# EAGLE design segment (EAGLE 5.10)
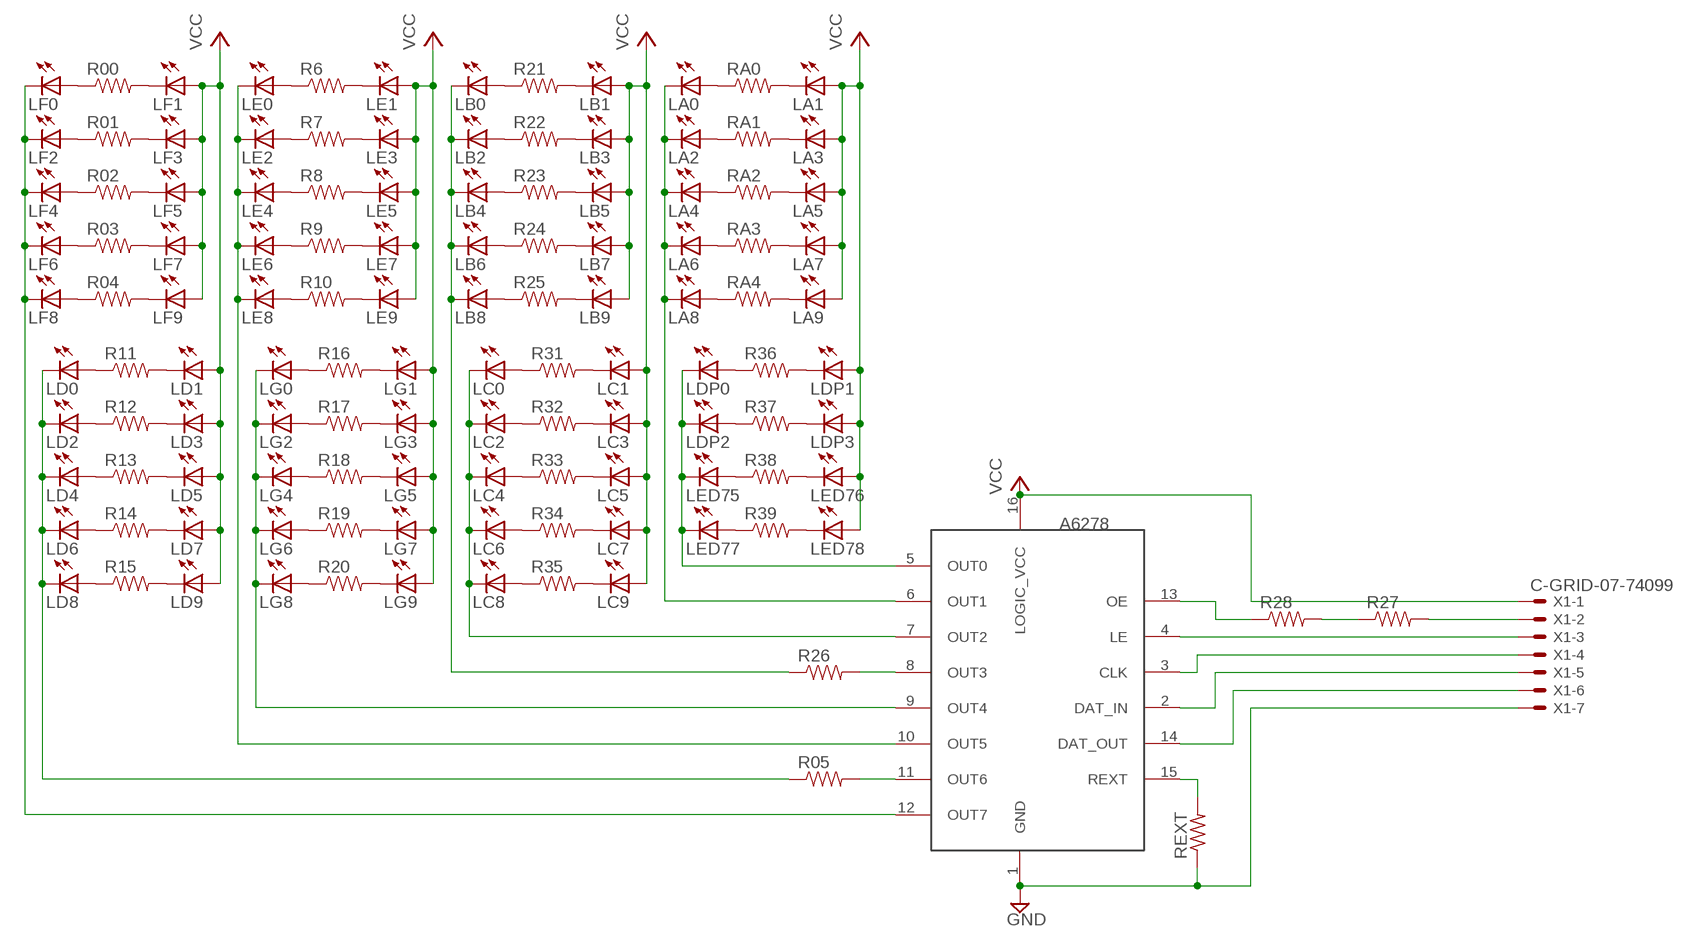
[diagram p0: schematic, sheet 1]

## Parts
LA0  LEDSMT1206  [1206]
LA1  LEDSMT1206  [1206]
LA2  LEDSMT1206  [1206]
LA3  LEDSMT1206  [1206]
LA4  LEDSMT1206  [1206]
LA5  LEDSMT1206  [1206]
LA6  LEDSMT1206  [1206]
LA7  LEDSMT1206  [1206]
LA8  LEDSMT1206  [1206]
LA9  LEDSMT1206  [1206]
LB0  LEDSMT1206  [1206]
LB1  LEDSMT1206  [1206]
LB2  LEDSMT1206  [1206]
LB3  LEDSMT1206  [1206]
LB4  LEDSMT1206  [1206]
LB5  LEDSMT1206  [1206]
LB6  LEDSMT1206  [1206]
LB7  LEDSMT1206  [1206]
LB8  LEDSMT1206  [1206]
LB9  LEDSMT1206  [1206]
LC0  LEDSMT1206  [1206]
LC1  LEDSMT1206  [1206]
LC2  LEDSMT1206  [1206]
LC3  LEDSMT1206  [1206]
LC4  LEDSMT1206  [1206]
LC5  LEDSMT1206  [1206]
LC6  LEDSMT1206  [1206]
LC7  LEDSMT1206  [1206]
LC8  LEDSMT1206  [1206]
LC9  LEDSMT1206  [1206]
LD0  LEDSMT1206  [1206]
LD1  LEDSMT1206  [1206]
LD2  LEDSMT1206  [1206]
LD3  LEDSMT1206  [1206]
LD4  LEDSMT1206  [1206]
LD5  LEDSMT1206  [1206]
LD6  LEDSMT1206  [1206]
LD7  LEDSMT1206  [1206]
LD8  LEDSMT1206  [1206]
LD9  LEDSMT1206  [1206]
LDP0  LEDSMT1206  [1206]
LDP1  LEDSMT1206  [1206]
LDP2  LEDSMT1206  [1206]
LDP3  LEDSMT1206  [1206]
LE0  LEDSMT1206  [1206]
LE1  LEDSMT1206  [1206]
LE2  LEDSMT1206  [1206]
LE3  LEDSMT1206  [1206]
LE4  LEDSMT1206  [1206]
LE5  LEDSMT1206  [1206]
LE6  LEDSMT1206  [1206]
LE7  LEDSMT1206  [1206]
LE8  LEDSMT1206  [1206]
LE9  LEDSMT1206  [1206]
LED75  LEDSMT1206  [1206]
LED76  LEDSMT1206  [1206]
LED77  LEDSMT1206  [1206]
LED78  LEDSMT1206  [1206]
LF0  LEDSMT1206  [1206]
LF1  LEDSMT1206  [1206]
LF2  LEDSMT1206  [1206]
LF3  LEDSMT1206  [1206]
LF4  LEDSMT1206  [1206]
LF5  LEDSMT1206  [1206]
LF6  LEDSMT1206  [1206]
LF7  LEDSMT1206  [1206]
LF8  LEDSMT1206  [1206]
LF9  LEDSMT1206  [1206]
LG0  LEDSMT1206  [1206]
LG1  LEDSMT1206  [1206]
LG2  LEDSMT1206  [1206]
LG3  LEDSMT1206  [1206]
LG4  LEDSMT1206  [1206]
LG5  LEDSMT1206  [1206]
LG6  LEDSMT1206  [1206]
LG7  LEDSMT1206  [1206]
LG8  LEDSMT1206  [1206]
LG9  LEDSMT1206  [1206]
R00  RESISTOR1206  [1206]
R01  RESISTOR1206  [1206]
R02  RESISTOR1206  [1206]
R03  RESISTOR1206  [1206]
R04  RESISTOR1206  [1206]
R05  RESISTOR1206  [1206]
R6  RESISTOR1206  [1206]
R7  RESISTOR1206  [1206]
R8  RESISTOR1206  [1206]
R9  RESISTOR1206  [1206]
R10  RESISTOR1206  [1206]
R11  RESISTOR1206  [1206]
R12  RESISTOR1206  [1206]
R13  RESISTOR1206  [1206]
R14  RESISTOR1206  [1206]
R15  RESISTOR1206  [1206]
R16  RESISTOR1206  [1206]
R17  RESISTOR1206  [1206]
R18  RESISTOR1206  [1206]
R19  RESISTOR1206  [1206]
R20  RESISTOR1206  [1206]
R21  RESISTOR1206  [1206]
R22  RESISTOR1206  [1206]
R23  RESISTOR1206  [1206]
R24  RESISTOR1206  [1206]
R25  RESISTOR1206  [1206]
R26  RESISTOR1206  [1206]
R27  RESISTOR1206  [1206]
R28  RESISTOR1206  [1206]
R31  RESISTOR1206  [1206]
R32  RESISTOR1206  [1206]
R33  RESISTOR1206  [1206]
R34  RESISTOR1206  [1206]
R35  RESISTOR1206  [1206]
R36  RESISTOR1206  [1206]
R37  RESISTOR1206  [1206]
R38  RESISTOR1206  [1206]
R39  RESISTOR1206  [1206]
RA0  RESISTOR1206  [1206]
RA1  RESISTOR1206  [1206]
RA2  RESISTOR1206  [1206]
RA3  RESISTOR1206  [1206]
RA4  RESISTOR1206  [1206]
REXT  R-US_R1206  [R1206]
U$1  A6278  [SO16W]
X1  C-GRID-07-74099  [74099-07]

## Nets
GND: REXT.1 U$1.1(GND) X1.7
N$1: LF0.A R00.1
N$2: LF1.C R00.2
N$3: LF2.A R01.1
N$4: LF3.C R01.2
N$5: LF4.A R02.1
N$6: LF5.C R02.2
N$7: LF6.A R03.1
N$8: LF7.C R03.2
N$9: LF8.A R04.1
N$10: LF9.C R04.2
N$11: LE0.A R6.1
N$12: LE1.C R6.2
N$13: LE2.A R7.1
N$14: LE3.C R7.2
N$15: LE4.A R8.1
N$16: LE5.C R8.2
N$17: LE6.A R9.1
N$18: LE7.C R9.2
N$19: LE8.A R10.1
N$20: LE9.C R10.2
N$21: LD0.A R11.1
N$22: LD1.C R11.2
N$23: LD2.A R12.1
N$24: LD3.C R12.2
N$25: LD4.A R13.1
N$26: LD5.C R13.2
N$27: LD6.A R14.1
N$28: LD7.C R14.2
N$29: LD8.A R15.1
N$30: LD9.C R15.2
N$31: LG0.A R16.1
N$32: LG1.C R16.2
N$33: LG2.A R17.1
N$34: LG3.C R17.2
N$35: LG4.A R18.1
N$36: LG5.C R18.2
N$37: LG6.A R19.1
N$38: LG7.C R19.2
N$39: LG8.A R20.1
N$40: LG9.C R20.2
N$41: LB0.A R21.1
N$42: LB1.C R21.2
N$43: LB2.A R22.1
N$44: LB3.C R22.2
N$45: LB4.A R23.1
N$46: LB5.C R23.2
N$47: LB6.A R24.1
N$48: LB7.C R24.2
N$49: LB8.A R25.1
N$50: LB9.C R25.2
N$51: LA0.A RA0.1
N$52: LA1.C RA0.2
N$53: LA2.A RA1.1
N$54: LA3.C RA1.2
N$55: LA4.A RA2.1
N$56: LA5.C RA2.2
N$57: LA6.A RA3.1
N$58: LA7.C RA3.2
N$59: LA8.A RA4.1
N$60: LA9.C RA4.2
N$61: LC0.A R31.1
N$62: LC1.C R31.2
N$63: LC2.A R32.1
N$64: LC3.C R32.2
N$65: LC4.A R33.1
N$66: LC5.C R33.2
N$67: LC6.A R34.1
N$68: LC7.C R34.2
N$69: LC8.A R35.1
N$70: LC9.C R35.2
N$71: LDP0.A R36.1
N$72: LDP1.C R36.2
N$73: LDP2.A R37.1
N$74: LDP3.C R37.2
N$75: LED75.A R38.1
N$76: LED76.C R38.2
N$77: LED77.A R39.1
N$78: LED78.C R39.2
N$79: LF0.C LF2.C LF4.C LF6.C LF8.C U$1.12(OUT7)
N$80: LE0.C LE2.C LE4.C LE6.C LE8.C U$1.10(OUT5)
N$81: LB0.C LB2.C LB4.C LB6.C LB8.C R26.1
N$82: LA0.C LA2.C LA4.C LA6.C LA8.C U$1.6(OUT1)
N$83: LD0.C LD2.C LD4.C LD6.C LD8.C R05.1
N$84: LG0.C LG2.C LG4.C LG6.C LG8.C U$1.9(OUT4)
N$85: LC0.C LC2.C LC4.C LC6.C LC8.C U$1.7(OUT2)
N$86: REXT.2 U$1.15(REXT)
N$87: LDP0.C LDP2.C LED75.C LED77.C U$1.5(OUT0)
N$88: R28.1 U$1.13(OE)
N$89: U$1.4(LE) X1.3
N$90: U$1.3(CLK) X1.4
N$91: U$1.2(DAT_IN) X1.5
N$92: U$1.14(DAT_OUT) X1.6
N$93: R05.2 U$1.11(OUT6)
N$94: R26.2 U$1.8(OUT3)
N$95: R27.2 X1.2
N$96: R27.1 R28.2
VCC: LA1.A LA3.A LA5.A LA7.A LA9.A LB1.A LB3.A LB5.A LB7.A LB9.A LC1.A LC3.A LC5.A LC7.A LC9.A LD1.A LD3.A LD5.A LD7.A LD9.A LDP1.A LDP3.A LE1.A LE3.A LE5.A LE7.A LE9.A LED76.A LED78.A LF1.A LF3.A LF5.A LF7.A LF9.A LG1.A LG3.A LG5.A LG7.A LG9.A U$1.16(LOGIC_VCC) X1.1

## Library data of the parts
LA0 LA1-LA9 LB0 LB1-LB9 LC0 LC1-LC9 LD0 LD1-LD9 LDP0 LDP1-LDP3 LE0 LE1-LE9 LED75-LED78 LF0 LF1-LF9 LG0 LG1-LG9 = led:LED: LED OSRAM: - CHIPLED LG R971, LG N971, LY N971, LG Q971, LY Q971, LO R971, LY R971 LH N974, LH R974 LS Q976, LO Q976, LY Q976 LO Q996 - Hyper CHIPLED LW Q18S LB Q993, LB Q99A, LB R99A - SideLED LS A670, LO A670, LY A670, LG A670, LP A670 LB A673, LV A673, LT A673, LW A673 LH A674 LY A675 LS A676, LA A676, LO A676, LY A676, LW A676 LS A679, LY A679, LG A679 - Hyper Micro SIDELED® LS Y876, LA Y876, LO Y876, LY Y876 LT Y87S - SmartLED LW L88C, LW L88S LB L89C, LB L89S, LG L890 LS L89K, LO L89K, LY L89K LS L896, LA L896, LO L896, LY L896 - TOPLED LS T670, LO T670, LY T670, LG T670, LP T670 LSG T670, LSP T670, LSY T670, LOP T670, LYG T670 LG T671, LOG T671, LSG T671 LB T673, LV T673, LT T673, LW T673 LH T674 LS T676, LA T676, LO T676, LY T676, LB T676, LH T676, LSB T676, LW T676 LB T67C, LV T67C, LT T67C, LS T67K, LO T67K, LY T67K, LW E67C LS E67B, LA E67B, LO E67B, LY E67B, LB E67C, LV E67C, LT E67C LW T67C LS T679, LY T679, LG T679 LS T770, LO T770, LY T770, LG T770, LP T770 LB T773, LV T773, LT T773, LW T773 LH T774 LS E675, LA E675, LY E675, LS T675 LS T776, LA T776, LO T776, LY T776, LB T776 LHGB T686 LT T68C, LB T68C - Hyper Mini TOPLED® LB M676 - Mini TOPLED Santana® LG M470 LS M47K, LO M47K, LY M47K Source: http://www.osram.convergy.de LUXEON: - LUMILED® LXK2-PW12-R00, LXK2-PW12-S00, LXK2-PW14-U00, LXK2-PW14-V00 LXK2-PM12-R00, LXK2-PM12-S00, LXK2-PM14-U00 LXK2-PE12-Q00, LXK2-PE12-R00, LXK2-PE12-S00, LXK2-PE14-T00, LXK2-PE14-U00 LXK2-PB12-K00, LXK2-PB12-L00, LXK2-PB12-M00, LXK2-PB14-N00, LXK2-PB14-P00, LXK2-PB14-Q00 LXK2-PR12-L00, LXK2-PR12-M00, LXK2-PR14-Q00, LXK2-PR14-R00 LXK2-PD12-Q00, LXK2-PD12-R00, LXK2-PD12-S00 LXK2-PH12-R00, LXK2-PH12-S00 LXK2-PL12-P00, LXK2-PL12-Q00, LXK2-PL12-R00 Source: www.luxeon.com KINGBRIGHT: KA-3528ASYC Source: www.kingbright.com
R00 R01-R05 R6-R28 R31-R39 RA0 RA1-RA4 = SparkFun:RESISTOR: Resistor Basic schematic elements and footprints for 0603, 1206, and PTH 1/10th watt (small) resistors.
REXT = rcl:R-US_: RESISTOR, American symbol
U$1 = allegro-sr:A6278
X1 = con-molex:C-GRID-07: CONNECTOR wire to board 2.54 mm (0.100") pitch header

## Board
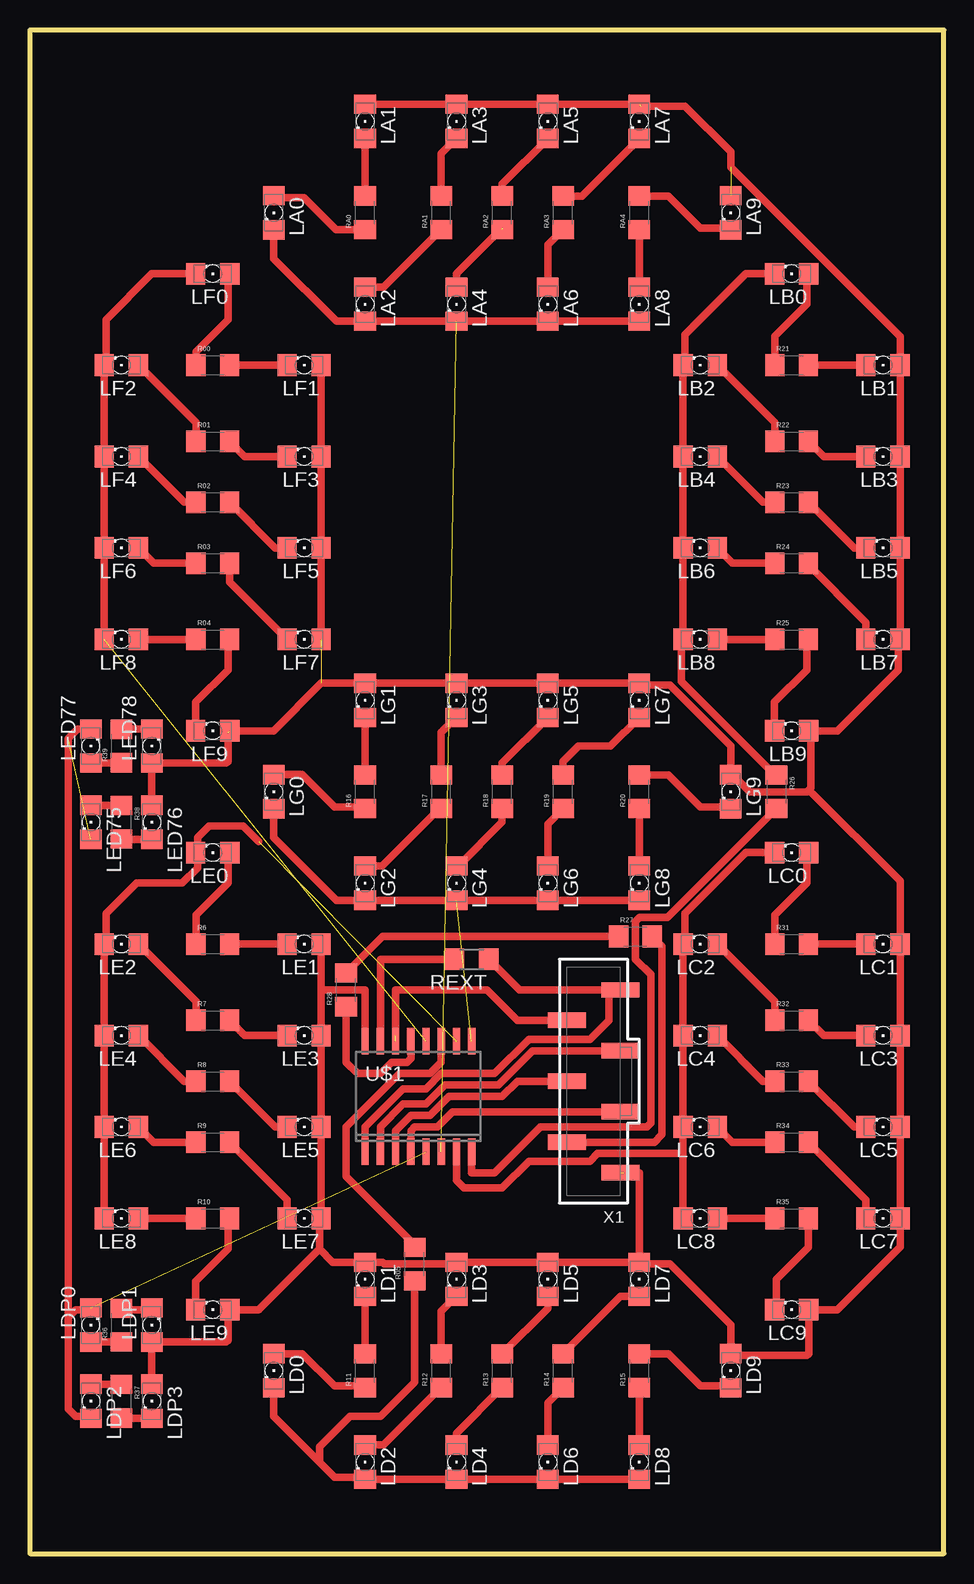
[diagram p1: board, top side]

Size 76.2 x 127 mm. Coordinates in mm from the lower left corner, seen from the top.
Outline: 0,0 0,127 76.2,127 76.2,0 0,0
Copper layers (1*16): Top 0.035mm / dielectric 1.5mm / Bottom 0.035mm
Design rules "default": minimum track width 10mil, minimum drill 24mil, track to track 8mil, track to pad 8mil, pad to pad 8mil, via to via 8mil, smd to smd 8mil, copper to edge 40mil, drill to drill 8mil, minimum pad ring 10mil, minimum via ring 8mil, stop-mask expansion 4mil, vias tented up to drill 0mil, thermal gap 10mil

### Footprints (pad centres in the part's own frame; a part is rotated, then mirrored left to right if it is on the bottom)
1206 = smd 1.6 x 1.803: A -1.422,0; C 1.422,0
1206' = smd 1.6 x 1.8: 1 -1.4,0; 2 1.4,0
R1206 = smd 1.6 x 1.803: 1 -1.422,0; 2 1.422,0
SO16W = smd 0.6 x 2.2: 1 -4.445,-4.6; 2 -3.175,-4.6; 3 -1.905,-4.6; 4 -0.635,-4.6; 5 0.635,-4.6; 6 1.905,-4.6; 7 3.175,-4.6; 8 4.445,-4.6; 9 4.445,4.6; 10 3.175,4.6; 11 1.905,4.6; 12 0.635,4.6; 13 -0.635,4.6; 14 -1.905,4.6; 15 -3.175,4.6; 16 -4.445,4.6
74099-07 = smd 1.27 x 3.175: 1 -7.62,-2.223; 2 -5.08,2.223; 3 -2.54,-2.223; 4 0,2.223; 5 2.54,-2.223; 6 5.08,2.223; 7 7.62,-2.223

### Placement (x,y rotation side)
LA0  20.32,111.76 270 top
LA1  27.94,119.38 270 top
LA2  27.94,104.14 270 top
LA3  35.56,119.38 270 top
LA4  35.56,104.14 270 top
LA5  43.18,119.38 270 top
LA6  43.18,104.14 270 top
LA7  50.8,119.38 270 top
LA8  50.8,104.14 270 top
LA9  58.42,111.76 270 top
LB0  63.5,106.68 180 top
LB1  71.12,99.06 180 top
LB2  55.88,99.06 180 top
LB3  71.12,91.44 180 top
LB4  55.88,91.44 180 top
LB5  71.12,83.82 180 top
LB6  55.88,83.82 180 top
LB7  71.12,76.2 180 top
LB8  55.88,76.2 180 top
LB9  63.5,68.58 180 top
LC0  63.5,58.42 180 top
LC1  71.12,50.8 180 top
LC2  55.88,50.8 180 top
LC3  71.12,43.18 180 top
LC4  55.88,43.18 180 top
LC5  71.12,35.56 180 top
LC6  55.88,35.56 180 top
LC7  71.12,27.94 180 top
LC8  55.88,27.94 180 top
LC9  63.5,20.32 180 top
LD0  20.32,15.24 270 top
LD1  27.94,22.86 270 top
LD2  27.94,7.62 270 top
LD3  35.56,22.86 270 top
LD4  35.56,7.62 270 top
LD5  43.18,22.86 270 top
LD6  43.18,7.62 270 top
LD7  50.8,22.86 270 top
LD8  50.8,7.62 270 top
LD9  58.42,15.24 270 top
LDP0  5.08,19.05 90 top
LDP1  10.16,19.05 90 top
LDP2  5.08,12.7 270 top
LDP3  10.16,12.7 270 top
LE0  15.24,58.42 180 top
LE1  22.86,50.8 180 top
LE2  7.62,50.8 180 top
LE3  22.86,43.18 180 top
LE4  7.62,43.18 180 top
LE5  22.86,35.56 180 top
LE6  7.62,35.56 180 top
LE7  22.86,27.94 180 top
LE8  7.62,27.94 180 top
LE9  15.24,20.32 180 top
LED75  5.08,60.96 270 top
LED76  10.16,60.96 270 top
LED77  5.08,67.31 90 top
LED78  10.16,67.31 90 top
LF0  15.24,106.68 180 top
LF1  22.86,99.06 180 top
LF2  7.62,99.06 180 top
LF3  22.86,91.44 180 top
LF4  7.62,91.44 180 top
LF5  22.86,83.82 180 top
LF6  7.62,83.82 180 top
LF7  22.86,76.2 180 top
LF8  7.62,76.2 180 top
LF9  15.24,68.58 180 top
LG0  20.32,63.5 270 top
LG1  27.94,71.12 270 top
LG2  27.94,55.88 270 top
LG3  35.56,71.12 270 top
LG4  35.56,55.88 270 top
LG5  43.18,71.12 270 top
LG6  43.18,55.88 270 top
LG7  50.8,71.12 270 top
LG8  50.8,55.88 270 top
LG9  58.42,63.5 270 top
R00  [1206']  15.24,99.06 0 top
R01  [1206']  15.24,92.71 0 top
R02  [1206']  15.24,87.63 0 top
R03  [1206']  15.24,82.55 0 top
R04  [1206']  15.24,76.2 0 top
R05  [1206']  32.07,24.13 90 top
R6  [1206']  15.24,50.8 0 top
R7  [1206']  15.24,44.45 0 top
R8  [1206']  15.24,39.37 0 top
R9  [1206']  15.24,34.29 0 top
R10  [1206']  15.24,27.94 0 top
R11  [1206']  27.94,15.24 90 top
R12  [1206']  34.29,15.24 90 top
R13  [1206']  39.37,15.24 90 top
R14  [1206']  44.45,15.24 90 top
R15  [1206']  50.8,15.24 90 top
R16  [1206']  27.94,63.5 90 top
R17  [1206']  34.29,63.5 90 top
R18  [1206']  39.37,63.5 90 top
R19  [1206']  44.45,63.5 90 top
R20  [1206']  50.8,63.5 90 top
R21  [1206']  63.5,99.06 0 top
R22  [1206']  63.5,92.71 0 top
R23  [1206']  63.5,87.63 0 top
R24  [1206']  63.5,82.55 0 top
R25  [1206']  63.5,76.2 0 top
R26  [1206']  62.23,63.5 270 top
R27  [1206']  50.48,51.44 0 top
R28  [1206']  26.35,46.99 90 top
R31  [1206']  63.5,50.8 0 top
R32  [1206']  63.5,44.45 0 top
R33  [1206']  63.5,39.37 0 top
R34  [1206']  63.5,34.29 0 top
R35  [1206']  63.5,27.94 0 top
R36  [1206']  7.62,19.05 90 top
R37  [1206']  7.62,12.7 270 top
R38  [1206']  7.62,60.96 270 top
R39  [1206']  7.62,67.31 90 top
RA0  [1206']  27.94,111.76 90 top
RA1  [1206']  34.29,111.76 90 top
RA2  [1206']  39.37,111.76 90 top
RA3  [1206']  44.45,111.76 90 top
RA4  [1206']  50.8,111.76 90 top
REXT  36.83,49.53 180 top
U$1  32.38,38.1 0 top
X1  46.99,39.37 90 top

### Tracks (layer width: path | path; a pad name or v marks a point on that pad's centre or on a via)
GND
  Top 0.61: 48.58,46.99 40.79,46.99 REXT.1 | 48.58,46.99 X1.7 | U$1.1 27.94,35.56 31.11,38.73 33.02,38.73 34.29,40.01 38.73,40.01 41.59,42.86 46.67,42.86 48.26,44.45 48.26,46.67 48.58,46.99
N$1
  Top 0.61: LF0.A 16.51,106.53 16.51,102.87 13.84,100.2 R00.1
N$2
  Top 0.61: R00.2 LF1.C
N$3
  Top 0.61: LF2.A 13.84,94.26 R01.1
N$4
  Top 0.61: R01.2 17.91,91.44 LF3.C
N$5
  Top 0.61: LF4.A 12.85,87.63 R02.1
N$6
  Top 0.61: R02.2 20.45,83.82 LF5.C
N$7
  Top 0.61: LF6.A 10.31,82.55 R03.1
N$8
  Top 0.61: LF7.C 16.64,81 R03.2
N$9
  Top 0.61: LF8.A R04.1
N$10
  Top 0.61: R04.2 16.51,76.07 16.51,73.66 13.82,70.97 LF9.C
N$11
  Top 0.61: LE0.A 16.51,58.27 16.51,55.88 13.84,53.21 R6.1
N$12
  Top 0.61: R6.2 LE1.C
N$13
  Top 0.61: LE2.A 13.84,46 R7.1
N$14
  Top 0.61: R7.2 17.91,43.18 LE3.C
N$15
  Top 0.61: LE4.A 12.85,39.37 R8.1
N$16
  Top 0.61: R8.2 20.45,35.56 LE5.C
N$17
  Top 0.61: LE6.A 10.31,34.29 R9.1
N$18
  Top 0.61: R9.2 21.44,29.49 LE7.C
N$19
  Top 0.61: 8.89,27.94 LE8.A R10.1
N$20
  Top 0.61: R10.2 16.51,27.81 16.51,25.4 13.82,22.71 LE9.C
N$21
  Top 0.61: R11.1 27.81,13.97 25.4,13.97 22.71,16.66 LD0.A
N$22
  Top 0.61: R11.2 LD1.C
N$23
  Top 0.61: R12.1 29.49,9.04 LD2.A
N$24
  Top 0.61: LD3.C 34.29,20.17 R12.2
N$25
  Top 0.61: R13.1 35.56,10.03 LD4.A
N$26
  Top 0.61: R13.2 43.18,20.45 LD5.C
N$27
  Top 0.61: R14.1 43.18,12.57 LD6.A
N$28
  Top 0.61: R14.2 49.25,21.44 LD7.C
N$29
  Top 0.61: LD8.A R15.1
N$30
  Top 0.61: LD9.C 58.27,13.97 55.88,13.97 53.21,16.64 R15.2
N$31
  Top 0.61: R16.1 27.94,62.23 25.4,62.23 22.71,64.92 LG0.A
N$32
  Top 0.61: 27.94,64.77 R16.2 LG1.C
N$33
  Top 0.61: R17.1 34.29,62.23 29.36,57.3 LG2.A
N$34
  Top 0.61: LG3.C 34.29,68.43 R17.2
N$35
  Top 0.61: R18.1 39.37,60.96 35.71,57.3 LG4.A
N$36
  Top 0.61: LG5.C 39.37,65.89 R18.2
N$37
  Top 0.61: R19.1 43.18,60.83 LG6.A
N$38
  Top 0.61: LG7.C 48.41,67.31 45.72,67.31 44.45,66.04 R19.2
N$39
  Top 0.61: LG8.A R20.1
N$40
  Top 0.61: LG9.C 58.27,62.23 55.88,62.23 53.21,64.9 R20.2
N$41
  Top 0.61: LB0.A 64.77,106.53 64.77,104.14 62.1,101.47 R21.1
N$42
  Top 0.61: R21.2 LB1.C
N$43
  Top 0.61: LB2.A 62.1,94.26 R22.1
N$44
  Top 0.61: R22.2 66.17,91.44 LB3.C
N$45
  Top 0.61: LB4.A 61.11,87.63 R23.1
N$46
  Top 0.61: R23.2 68.71,83.82 LB5.C
N$47
  Top 0.61: LB6.A 58.57,82.55 R24.1
N$48
  Top 0.61: R24.2 64.77,82.55 69.7,77.62 LB7.C
N$49
  Top 0.61: LB8.A R25.1
N$50
  Top 0.61: R25.2 64.77,76.07 64.77,73.66 62.08,70.97 LB9.C
N$51
  Top 0.61: RA0.1 25.53,110.36 22.86,113.03 20.47,113.03 LA0.A
N$52
  Top 0.61: RA0.2 LA1.C
N$53
  Top 0.61: LA2.A 29.49,105.56 RA1.1
N$54
  Top 0.61: RA1.2 34.29,116.69 LA3.C
N$55  (1 unrouted)
  Top 0.61: LA4.A 35.56,106.68 39.37,110.49
N$56
  Top 0.61: RA2.2 39.37,114.15 LA5.C
N$57
  Top 0.61: LA6.A 43.18,109.09 RA3.1
N$58
  Top 0.61: RA3.2 46,113.16 LA7.C
N$59
  Top 0.61: LA8.A RA4.1
N$60
  Top 0.61: RA4.2 53.21,113.16 55.88,110.49 58.27,110.49 LA9.C
N$61
  Top 0.61: LC0.A 64.77,58.42 64.77,55.88 62.1,53.21 R31.1
N$62
  Top 0.61: 69.85,50.8 LC1.C R31.2
N$63
  Top 0.61: LC2.A 62.1,46 R32.1
N$64
  Top 0.61: R32.2 66.17,43.18 LC3.C
N$65
  Top 0.61: LC4.A 61.11,39.37 R33.1
N$66
  Top 0.61: R33.2 68.71,35.56 LC5.C
N$67
  Top 0.61: LC6.A 58.57,34.29 R34.1
N$68
  Top 0.61: R34.2 69.7,29.49 LC7.C
N$69
  Top 0.61: LC8.A R35.1
N$70
  Top 0.61: LC9.C 62.23,20.47 62.23,22.86 64.9,25.53 R35.2
N$71
  Top 0.61: R36.1 5.1,17.65 LDP0.A
N$72
  Top 0.61: LDP1.C 10.16,20.32 7.75,20.32 R36.2
N$73
  Top 0.61: R37.1 5.1,14.1 LDP2.A
N$74
  Top 0.61: LDP3.C 7.64,11.28 R37.2
N$75
  Top 0.61: R38.1 5.1,62.36 LED75.A
N$76
  Top 0.61: LED76.C 7.64,59.54 R38.2
N$77
  Top 0.61: LED77.A 7.6,65.89 R39.1
N$78
  Top 0.61: R39.2 10.14,68.71 LED78.C
N$79  (1 unrouted)
  Top 0.61: LF0.C 10.16,106.68 6.35,102.87 6.35,99.21 LF2.C LF4.C LF6.C LF8.C
N$80  (1 unrouted)
  Top 0.61: 6.35,27.79 LE8.C LE6.C LE4.C LE2.C 6.35,50.95 6.35,53.34 8.89,55.88 12.7,55.88 13.97,57.15 13.97,58.42 | 13.97,58.42 LE0.C | 13.97,58.42 13.97,59.69 14.92,60.64 17.78,60.64 19.05,59.37
N$81
  Top 0.61: LB0.C 59.69,106.68 54.61,101.6 54.61,99.21 LB2.C LB4.C LB6.C LB8.C 54.29,76.03 54.29,72.71 62.1,64.9 R26.1
N$82  (1 unrouted)
  Top 0.61: LA8.C LA6.C LA4.C LA2.C 25.55,102.72 20.32,107.95 LA0.C
N$83
  Top 0.61: LD8.C LD6.C LD4.C LD2.C 27.79,6.35 25.4,6.35 24.13,7.62 | LD0.C 20.32,11.43 24.13,7.62 | 24.13,7.62 24.13,8.89 26.67,11.43 29.21,11.43 32.07,14.29 R05.1
N$84  (1 unrouted)
  Top 0.61: LG8.C LG6.C LG4.C LG2.C 25.55,54.46 20.32,59.69 LG0.C
N$85
  Top 0.61: LC8.C 54.61,27.94 54.46,28.09 54.46,33.34 | 54.46,33.34 LC6.C LC4.C LC2.C 54.61,50.95 54.61,53.34 59.69,58.42 LC0.C | U$1.7 35.56,31.11 36.2,30.48 39.37,30.48 41.59,32.7 46.67,32.7 47.31,33.34 54.46,33.34
N$86
  Top 0.61: U$1.15 29.21,49.53 REXT.2
N$87  (2 unrouted)
  Top 0.61: 3.17,19.68 3.81,20.32 4.93,20.32 LDP0.C | LED77.C 3.96,68.73 3.17,67.94 3.17,19.68 | 3.17,19.68 3.17,12.06 3.81,11.43 4.93,11.43 LDP2.C
N$88
  Top 0.61: U$1.13 31.75,41.27 31.43,40.96 30.16,40.96 29.21,40.01 27.3,40.01 26.35,40.96 R28.1
N$89
  Top 0.61: X1.3 35.24,36.83 33.97,35.56 32.07,35.56 31.75,35.24 U$1.4
N$90
  Top 0.61: X1.4 40.64,39.37 39.37,38.1 34.92,38.1 33.34,36.51 31.75,36.51 30.48,35.24 U$1.3
N$91
  Top 0.61: X1.5 41.91,41.91 39.05,39.05 34.61,39.05 33.02,37.47 31.11,37.47 29.21,35.56 U$1.2
N$92  (1 unrouted)
  Top 0.61: X1.6 40.64,44.45 38.1,46.99 30.48,46.99 30.48,43.18
N$93
  Top 0.61: R05.2 32.07,25.72 26.35,31.43 26.35,35.56 30.8,40.01 33.34,40.01 34.29,40.96 U$1.11
N$94
  Top 0.61: U$1.8 36.83,31.75 38.73,31.75 42.55,35.56 51.44,35.56 51.75,35.88 51.75,48.26 50.48,49.53 50.48,52.7 50.8,53.02 53.15,53.02 R26.2
N$95
  Top 0.61: X1.2 52.07,34.29 52.7,34.92 52.7,50.61 R27.2
N$96
  Top 0.61: R27.1 29.4,51.44 R28.2
VCC  (5 unrouted)
  Top 0.61: 50.95,120.65 54.61,120.65 58.42,116.84 58.42,115.57 72.54,101.45 LB1.A LB3.A 72.39,91.44 72.54,91.29 LB5.A LB7.A 72.39,76.2 72.39,73.66 67.31,68.58 LB9.A 65.09,68.42 65.09,63.82 64.93,63.66 | 24.28,46.99 LE3.A 24.28,35.71 24.13,35.56 LE5.A LE7.A 24.13,27.79 24.13,25.4 | 24.28,46.99 LE1.A | 24.13,25.4 19.05,20.32 LE9.A 16.51,20.17 16.51,17.78 16.36,17.63 LDP1.A LDP3.A | LD7.A LD5.A LD3.A 35.41,24.13 29.53,24.13 29.38,24.28 LD1.A 25.25,24.28 24.13,25.4 | LD7.A 50.95,24.13 53.34,24.13 58.42,19.05 LD9.A 58.57,16.51 64.77,16.51 64.92,16.66 LC9.A 67.31,20.32 72.54,25.55 LC7.A LC5.A LC3.A LC1.A 72.54,56.05 64.93,63.66 | LF7.A LF5.A LF3.A LF1.A | LA7.A LA5.A LA3.A LA1.A | LED76.A LED78.A 16.36,65.89 16.51,66.04 16.51,68.43 | LF9.A 20.32,68.58 24.28,72.54 LG1.A LG3.A LG5.A LG7.A 50.95,72.39 53.34,72.39 58.42,67.31 LG9.A 58.57,64.77 58.74,64.77 60.01,63.5 64.77,63.5 64.93,63.66 | LD7.A 50.8,31.75 49.53,31.75 | U$1.16 27.94,46.99 24.28,46.99